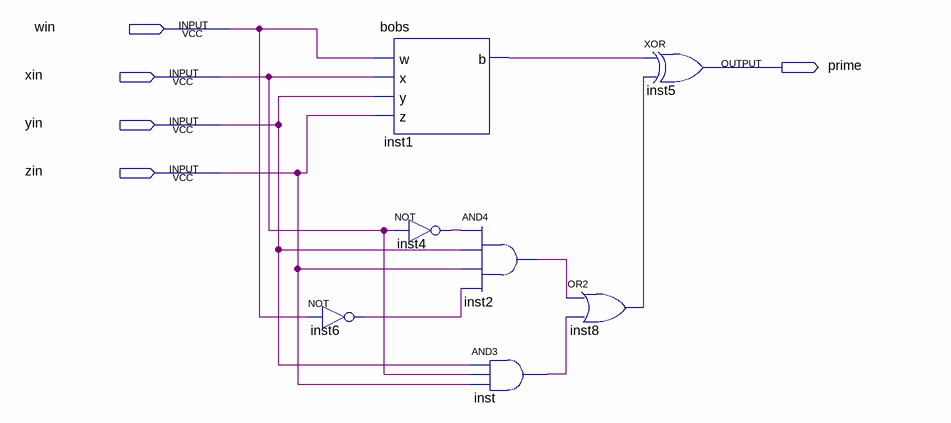
[diagram p0: schematic sheet]
// Quartus schematic mProj.bdf as structural Verilog: 7 symbols, 5 pins
module mProj (
  input  win,
  input  xin,
  input  yin,
  input  zin,
  output prime
);

  wire inst1_b, inst2_out, inst4_out, inst6_out, inst8_out, inst_out;

  not inst6 (inst6_out, win);
  bobs inst1 (.w(win), .x(xin), .y(yin), .z(zin), .b(inst1_b));
  not inst4 (inst4_out, xin);
  and inst2 (inst2_out, inst4_out, yin, zin, inst6_out);
  and inst (inst_out, yin, xin, zin);
  or inst8 (inst8_out, inst2_out, inst_out);
  xor inst5 (prime, inst1_b, inst8_out);
endmodule
